# EAGLE design kapcs (EAGLE 7.2.0)
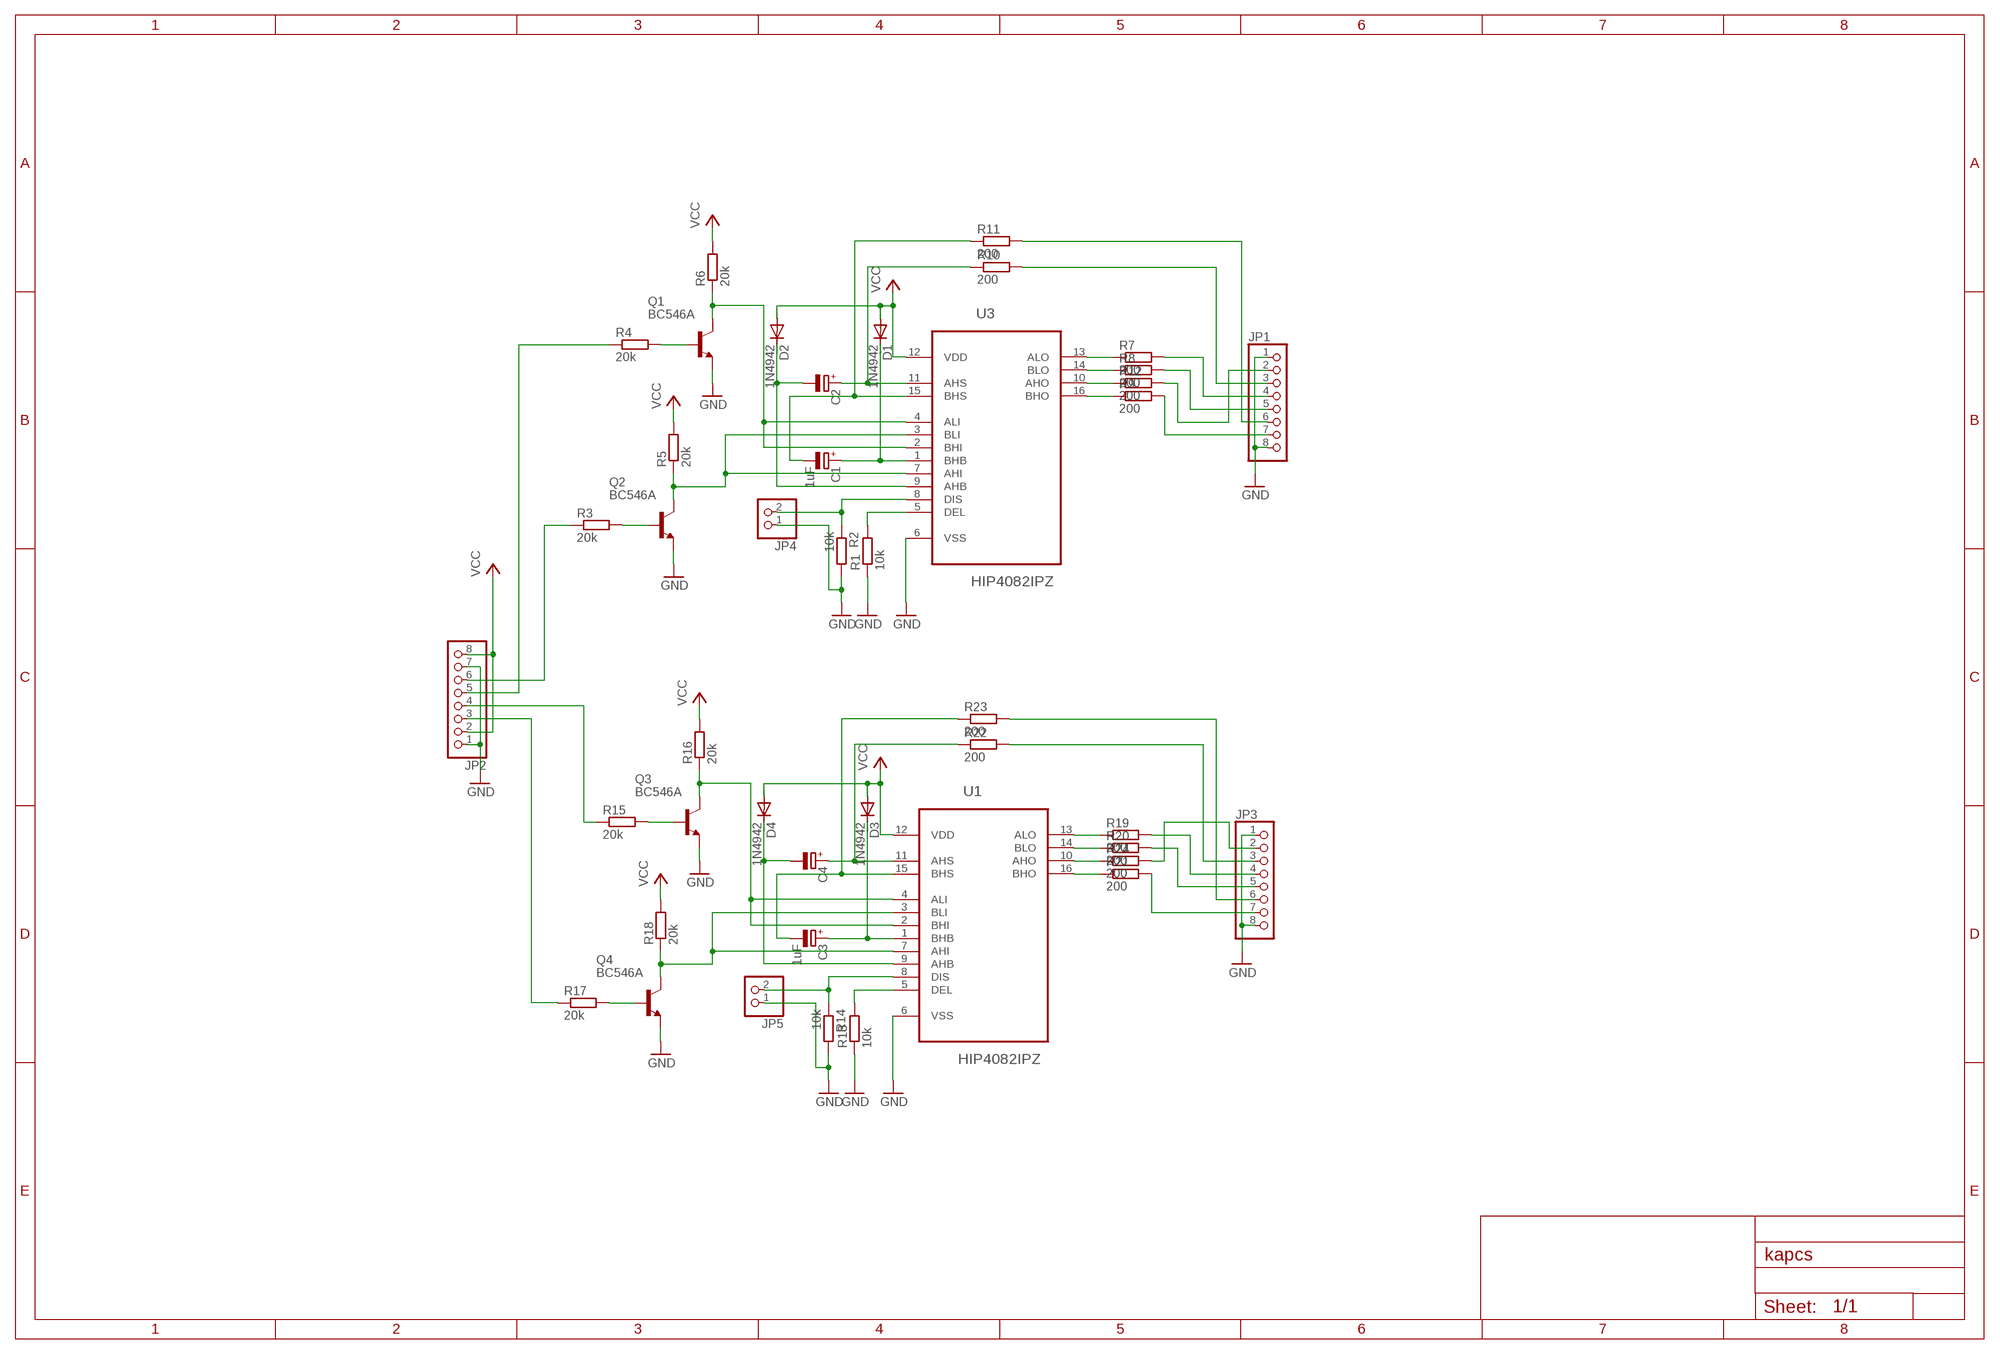
[diagram p0: schematic, sheet 1]

## Parts
C1  1uF  CPOL-EUE2.5-5  [E2,5-5]
C2  CPOL-EUE2.5-5  [E2,5-5]
C3  1uF  CPOL-EUE2.5-5  [E2,5-5]
C4  CPOL-EUE2.5-5  [E2,5-5]
D1  1N4942  [DO41-10]
D2  1N4942  [DO41-10]
D3  1N4942  [DO41-10]
D4  1N4942  [DO41-10]
JP1  PINHD-1X8  [1X08]
JP2  PINHD-1X8  [1X08]
JP3  PINHD-1X8  [1X08]
JP4  PINHD-1X2  [1X02]
JP5  PINHD-1X2  [1X02]
Q1  BC546A  [TO92-EBC]
Q2  BC546A  [TO92-EBC]
Q3  BC546A  [TO92-EBC]
Q4  BC546A  [TO92-EBC]
R1  10k  R-EU_0207/7  [0207/7]
R2  10k  R-EU_0207/7  [0207/7]
R3  20k  R-EU_0207/7  [0207/7]
R4  20k  R-EU_0207/7  [0207/7]
R5  20k  R-EU_0207/7  [0207/7]
R6  20k  R-EU_0207/7  [0207/7]
R7  200  R-EU_0207/7  [0207/7]
R8  200  R-EU_0207/7  [0207/7]
R9  200  R-EU_0207/7  [0207/7]
R10  200  R-EU_0207/7  [0207/7]
R11  200  R-EU_0207/7  [0207/7]
R12  200  R-EU_0207/7  [0207/7]
R13  10k  R-EU_0207/7  [0207/7]
R14  10k  R-EU_0207/7  [0207/7]
R15  20k  R-EU_0207/7  [0207/7]
R16  20k  R-EU_0207/7  [0207/7]
R17  20k  R-EU_0207/7  [0207/7]
R18  20k  R-EU_0207/7  [0207/7]
R19  200  R-EU_0207/7  [0207/7]
R20  200  R-EU_0207/7  [0207/7]
R21  200  R-EU_0207/7  [0207/7]
R22  200  R-EU_0207/7  [0207/7]
R23  200  R-EU_0207/7  [0207/7]
R24  200  R-EU_0207/7  [0207/7]
U1  HIP4082IPZ  [DIP254P762X533-16]
U3  HIP4082IPZ  [DIP254P762X533-16]

## Nets
GND: JP1.1 JP1.8 JP2.1 JP2.7 JP3.1 JP3.8 JP4.1 JP5.1 Q1.E Q2.E Q3.E Q4.E R1.1 R2.2 R13.1 R14.2 U1.6(VSS) U3.6(VSS)
N$1: C1.+ D1.C U3.1(BHB)
N$2: R1.2 U3.5(DEL)
N$3: C2.+ R10.1 U3.11(AHS)
N$4: C2.- D2.C U3.9(AHB)
N$5: C1.- R11.1 U3.15(BHS)
N$6: JP4.2 R2.1 U3.8(DIS)
N$7: Q1.B R4.2
N$8: R9.1 U3.16(BHO)
N$9: Q2.C R5.1 U3.3(BLI) U3.7(AHI)
N$10: Q2.B R3.2
N$11: Q1.C R6.1 U3.2(BHI) U3.4(ALI)
N$12: R12.1 U3.10(AHO)
N$13: R8.1 U3.14(BLO)
N$14: R7.1 U3.13(ALO)
N$16: JP1.3 R10.2
N$17: JP1.4 R7.2
N$18: JP1.5 R8.2
N$19: JP1.2 R12.2
N$20: JP1.7 R9.2
N$21: Q3.B R15.2
N$22: Q4.C R18.1 U1.3(BLI) U1.7(AHI)
N$23: Q4.B R17.2
N$24: Q3.C R16.1 U1.2(BHI) U1.4(ALI)
N$25: JP2.4 R15.1
N$26: C3.+ D3.C U1.1(BHB)
N$27: C3.- R23.1 U1.15(BHS)
N$28: C4.+ R22.1 U1.11(AHS)
N$29: C4.- D4.C U1.9(AHB)
N$30: R13.2 U1.5(DEL)
N$31: JP5.2 R14.1 U1.8(DIS)
N$32: R21.1 U1.16(BHO)
N$33: R24.1 U1.10(AHO)
N$34: R20.1 U1.14(BLO)
N$35: R19.1 U1.13(ALO)
N$36: JP3.6 R23.2
N$37: JP3.3 R22.2
N$38: JP3.4 R19.2
N$39: JP3.5 R20.2
N$40: JP3.2 R24.2
N$41: JP2.5 R4.1
N$42: JP2.6 R3.1
N$43: JP3.7 R21.2
N$44: JP2.3 R17.1
N$45: JP1.6 R11.2
VCC: D1.A D2.A D3.A D4.A JP2.2 JP2.8 R5.2 R6.2 R16.2 R18.2 U1.12(VDD) U3.12(VDD)

## Library data of the parts
C1-C4 = rcl:CPOL-EU: POLARIZED CAPACITOR, European symbol
D1-D4 = diode:1N4942: DIODE 1.0 A, 200 V, 150 ns
JP1-JP3 = pinhead:PINHD-1X8: PIN HEADER
JP4 JP5 = pinhead:PINHD-1X2: PIN HEADER
Q1-Q4 = transistor-npn:BC546*: NPN Transistor
R1-R24 = rcl:R-EU_: RESISTOR, European symbol
U1 U3 = hip4082dip:HIP4082IPZ: 80V, 1.25A Peak Current H-Bridge; MPN: HIP4082IPZ; OC_FARNELL: 9664149; OC_NEWARK: 61J5962; PACKAGE: PDIP-16; SUPPLIER: INTERSIL

## Board
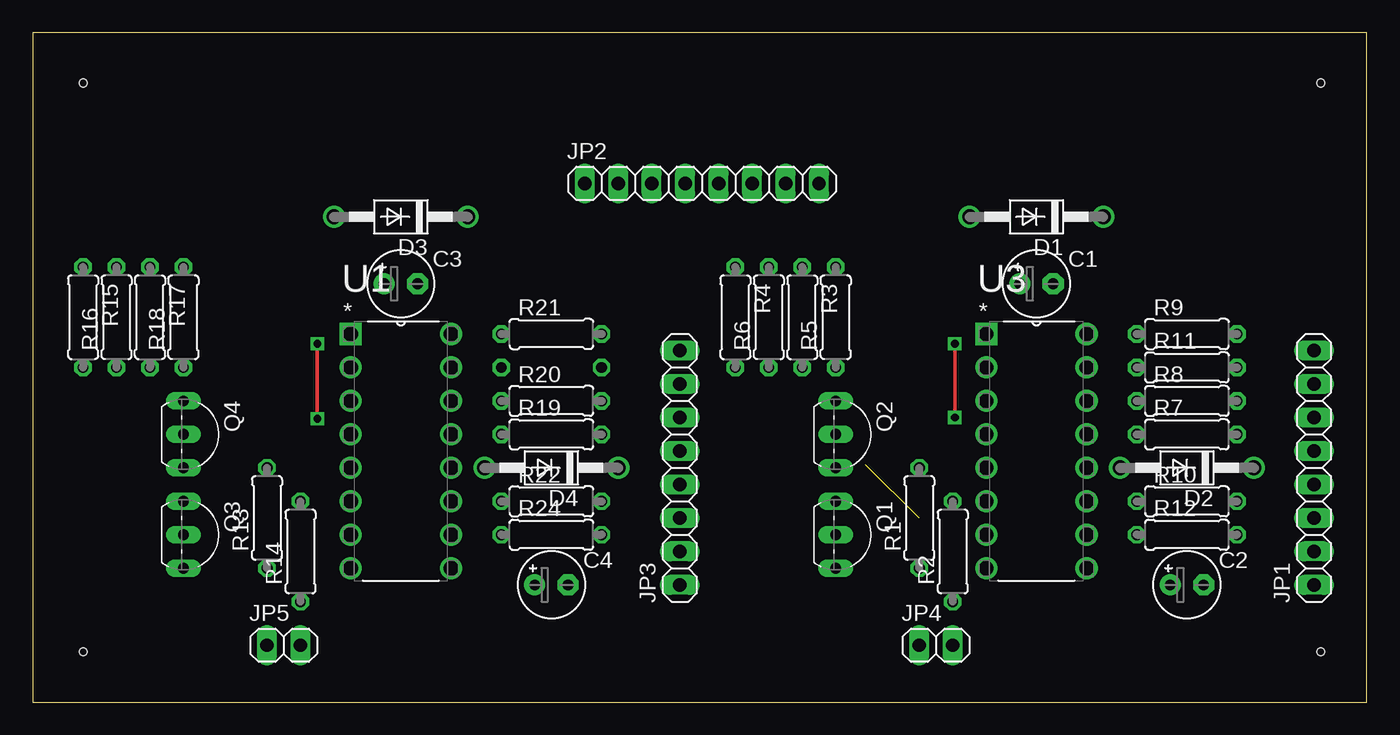
[diagram p1: board, top side]
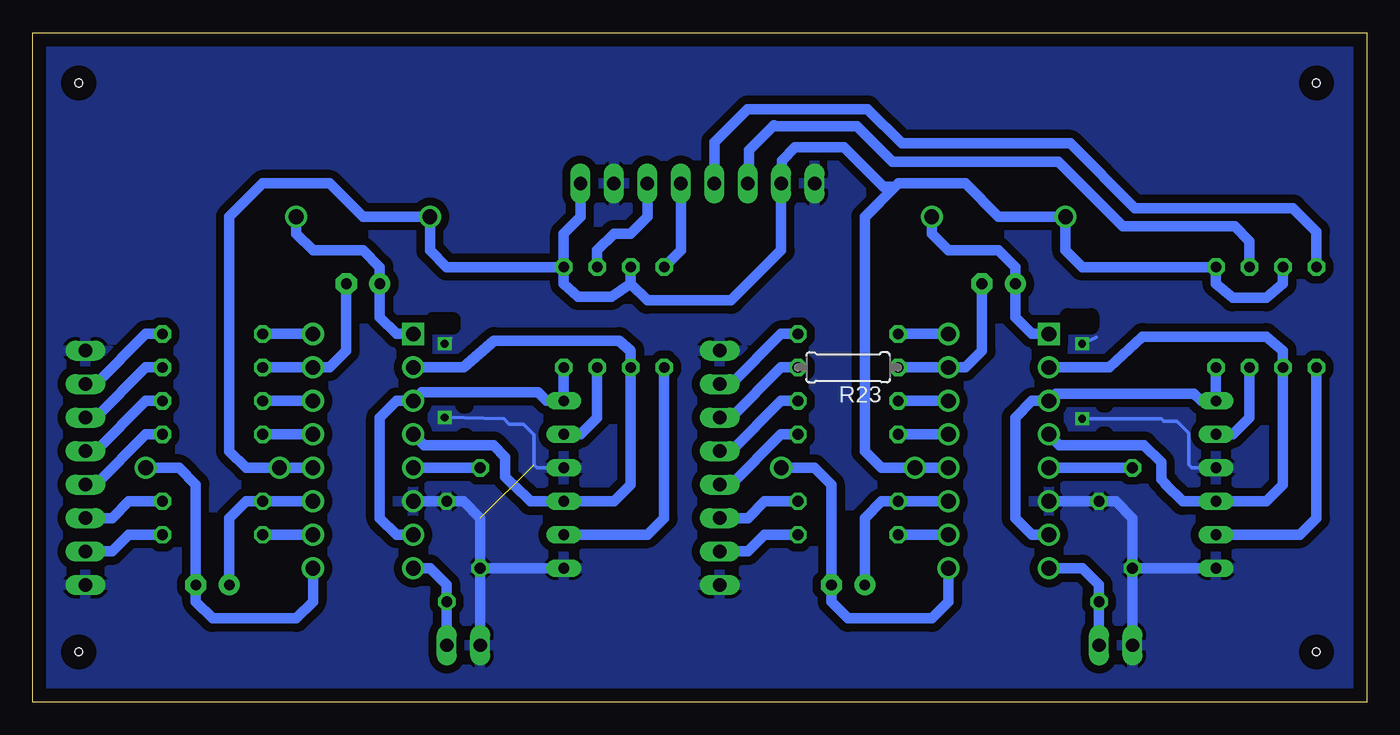
[diagram p2: board, bottom side, seen from below]

Size 101.27 x 50.79 mm. Coordinates in mm from the lower left corner, seen from the top.
Outline: 0,0 101.27,0 101.27,50.79 0,50.79 0,0
Copper layers (1*16): Top 0.035mm / dielectric 1.5mm / Bottom 0.035mm
Design rules "default": minimum track width 10mil, minimum drill 24mil, track to track 8mil, track to pad 8mil, pad to pad 8mil, via to via 8mil, smd to smd 8mil, copper to edge 40mil, drill to drill 8mil, minimum pad ring 10mil, minimum via ring 8mil, stop-mask expansion 4mil, vias tented up to drill 0mil, thermal gap 10mil
Holes 0.6 mm at 3.81,3.81 3.81,46.99 97.79,46.99 97.79,3.81
bRestrict: area 68.4,22.5 to 68.6,22.7; area 68.4,20 to 68.6,20.2; area 69.4,28.5 to 70.9,29; area 19.8,22.6 to 20,22.8; area 19.8,20.1 to 20,20.3; area 20.9,28.5 to 22.7,29.3

### Footprints (pad centres in the part's own frame; a part is rotated, then mirrored left to right if it is on the bottom)
E2,5-5 = drill 0.813 pad 1.6: + -1.27,0 | drill 0.813 pad 1.6 octagon: - 1.27,0
DO41-10 = drill 1.118: A 5.08,0; C -5.08,0
1X08 = drill 1.016 long: 1 -8.89,0; 2 -6.35,0; 3 -3.81,0; 4 -1.27,0; 5 1.27,0; 6 3.81,0; 7 6.35,0; 8 8.89,0
1X02 = drill 1.016 long: 1 -1.27,0; 2 1.27,0
TO92-EBC = drill 0.813 long: B 0,-1.27; C -2.54,-1.27; E 2.54,-1.27
0207/7 = drill 0.813 octagon: 1 -3.81,0; 2 3.81,0
DIP254P762X533-16 = drill 1.118 square: 1 -7.62,17.78 | drill 1.118: 2 -7.62,15.24; 3 -7.62,12.7; 4 -7.62,10.16; 5 -7.62,7.62; 6 -7.62,5.08; 7 -7.62,2.54; 8 -7.62,0; 9 0,0; 10 0,2.54; 11 0,5.08; 12 0,7.62; 13 0,10.16; 14 0,12.7; 15 0,15.24; 16 0,17.78

### Placement (x,y rotation side)
C1  76.2,31.75 0 top
C2  87.63,8.89 0 top
C3  27.94,31.75 0 top
C4  39.37,8.89 0 top
D1  76.2,36.83 180 top
D2  87.63,17.78 180 top
D3  27.94,36.83 180 top
D4  39.37,17.78 180 top
JP1  97.29,17.78 90 top
JP2  50.8,39.37 0 top
JP3  49.13,17.78 90 top
JP4  68.58,4.31 0 top
JP5  19.05,4.31 0 top
Q1  62.23,12.7 270 top
Q2  62.23,20.32 270 top
Q3  12.7,12.7 270 top
Q4  12.7,20.32 270 top
R1  67.31,13.97 90 top
R2  69.85,11.43 90 top
R3  58.42,29.21 270 top
R4  53.34,29.21 270 top
R5  60.96,29.21 90 top
R6  55.88,29.21 90 top
R7  87.63,20.32 0 top
R8  87.63,22.86 0 top
R9  87.63,27.94 0 top
R10  87.63,15.24 0 top
R11  87.63,25.4 0 top
R12  87.63,12.7 0 top
R13  17.78,13.97 90 top
R14  20.32,11.43 90 top
R15  3.81,29.21 270 top
R16  6.35,29.21 90 top
R17  8.89,29.21 270 top
R18  11.43,29.21 90 top
R19  39.37,20.32 0 top
R20  39.37,22.86 0 top
R21  39.37,27.94 0 top
R22  39.37,15.24 0 top
R23  39.37,25.4 180 bottom
R24  39.37,12.7 0 top
U1  31.75,10.16 0 top
U3  80.01,10.16 0 top

### Tracks (layer width: path | path; a pad name or v marks a point on that pad's centre or on a via)
GND  (via drill 0.6)  (1 unrouted)
  Top 0.254: v70,21.6 v70,27.2 | v21.6,21.5 v21.6,27.2
  Bottom 0.254: Q2.E 62.98,17.78 63.2,18 63.2,20.3 64,21.1 65.1,21.1 65.5,21.5 v70,21.6 | v70,27.2 69.5,27.6 | Q4.E 13.28,17.78 13.5,18 13.5,20.4 14.4,21.3 15.4,21.3 15.6,21.5 v21.6,21.5 | v21.6,27.2 20.5,27.7
  Bottom 0.813: JP5.1 R13.1 | R13.1 Q3.E | R13.1 17.78,13.97 19.05,15.24 R14.2 U1.6 | JP4.1 R1.1 | R1.1 Q1.E | R1.1 67.31,13.97 68.58,15.24 R2.2 U3.6
  pour Bottom (isolate 0.61): 0,50.8 101.6,50.8 101.6,0 0,0
N$1
  Bottom 0.813: D1.C 81.28,35.56 80.01,34.29 76.2,34.29 74.93,33.02 C1.+ 74.93,29.21 73.66,27.94 U3.1
N$2
  Bottom 0.813: R1.2 U3.5
N$3
  Bottom 0.813: U3.11 R10.1 85.09,15.24 86.36,13.97 C2.+
N$4
  Bottom 0.813: U3.9 80.01,7.62 81.28,6.35 87.63,6.35 88.9,7.62 C2.- 88.9,16.51 90.17,17.78 D2.C
N$5
  Bottom 0.813: R11.1 U3.15 78.74,25.4 77.47,26.67 C1.-
N$6
  Bottom 0.813: JP4.2 R2.1 69.85,8.89 71.12,10.16 U3.8
N$7
  Bottom 0.813: Q1.B 54.61,12.7 53.34,13.97 R4.2
N$8
  Bottom 0.813: U3.16 R9.1
N$9
  Bottom 0.813: U3.7 73.66,12.7 74.93,13.97 74.93,21.59 73.66,22.86 U3.3 71.75,23.5 62.9,23.5 62.26,22.86 Q2.C R5.1
N$10
  Bottom 0.813: Q2.B 59.69,20.32 58.42,21.59 R3.2
N$11
  Bottom 0.813: U3.2 68.58,25.4 66.24,27.44 56.75,27.44 55.88,26.67 R6.1 55.88,16.51 57.15,15.24 Q1.C 63.5,15.24 64.77,16.51 64.81,16.51 65.4,17.1 65.4,18.6 66.3,19.5 71.57,19.5 U3.4
N$12
  Bottom 0.813: U3.10 R12.1
N$13
  Bottom 0.813: U3.14 R8.1
N$14
  Bottom 0.813: U3.13 R7.1
N$16
  Bottom 0.813: R10.2 93.98,15.24 95.25,13.97 JP1.3
N$17
  Bottom 0.813: R7.2 92.71,20.32 96.52,16.51 JP1.4
N$18
  Bottom 0.813: R8.2 92.71,22.86 96.52,19.05 JP1.5
N$19
  Bottom 0.813: R12.2 93.98,12.7 95.25,11.43 JP1.2
N$20
  Bottom 0.813: R9.2 92.71,27.94 96.52,24.13 JP1.7
N$21
  Bottom 0.813: Q3.B 5.08,12.7 3.81,13.97 R15.2
N$22
  Bottom 0.813: R18.1 Q4.C 12.56,22.86 13.1,23.4 23.59,23.4 U1.3 25.4,22.86 26.67,21.59 26.67,13.97 25.4,12.7 U1.7
N$23
  Bottom 0.813: Q4.B 10.16,20.32 8.89,21.59 R17.2
N$24
  Bottom 0.813: U1.2 19.55,25.4 17.01,27.74 7.62,27.74 6.35,26.67 R16.1 6.35,16.51 7.62,15.24 Q3.C 13.97,15.24 15.24,16.51 15.24,16.54 15.6,16.9 15.6,18.2 16.9,19.5 23.31,19.5 U1.4
N$25
  Bottom 0.813: JP2.4 49.5,39.4 49.5,42.5 47,45 37.9,45 35.3,42.4 22.5,42.4 17.6,37.5 5.6,37.5 3.81,35.71 R15.1
N$26
  Bottom 0.813: U1.1 25.4,27.94 26.67,29.21 C3.+ 26.67,33.02 27.94,34.29 31.75,34.29 33.02,35.56 D3.C
N$27
  Bottom 0.813: R23.1 U1.15 30.48,25.4 29.21,26.67 C3.-
N$28
  Bottom 0.813: U1.11 R22.1 36.83,15.24 38.1,13.97 C4.+
N$29
  Bottom 0.813: D4.C 41.91,17.78 40.64,16.51 C4.- 40.64,7.62 39.37,6.35 33.02,6.35 31.75,7.62 U1.9
N$30
  Bottom 0.813: R13.2 U1.5
N$31
  Bottom 0.813: U1.8 21.59,10.16 20.32,8.89 R14.1 JP5.2
N$32
  Bottom 0.813: U1.16 R21.1
N$33
  Bottom 0.813: U1.10 R24.1
N$34
  Bottom 0.813: U1.14 R20.1
N$35
  Bottom 0.813: U1.13 R19.1
N$36
  Bottom 0.813: R23.2 44.45,25.4 48.26,21.59 JP3.6
N$37
  Bottom 0.813: R22.2 45.72,15.24 46.99,13.97 JP3.3
N$38
  Bottom 0.813: R19.2 44.45,20.32 48.26,16.51 JP3.4
N$39
  Bottom 0.813: R20.2 44.45,22.86 48.26,19.05 JP3.5
N$40
  Bottom 0.813: R24.2 45.72,12.7 46.99,11.43 JP3.2
N$41
  Bottom 0.813: JP2.5 52.07,34.29 R4.1
N$42
  Bottom 0.813: JP2.6 54.61,36.83 55.88,35.56 57.15,35.56 58.42,34.29 R3.1
N$43
  Bottom 0.813: R21.2 44.45,27.94 48.26,24.13 JP3.7
N$44
  Bottom 0.813: 46.99,40.64 JP2.3 46.9,39.46 46.9,41.9 45,43.8 44.9,43.7 38.7,43.7 36,41 23.4,41 18.5,36.1 10,36.1 8.89,34.99 R17.1
N$45
  Bottom 0.813: R11.2 92.71,25.4 96.52,21.59 JP1.6
VCC
  Bottom 0.813: U1.12 D4.A 36.83,17.78 38.1,19.05 38.1,36.83 | 38.1,36.83 35.56,39.37 30.48,39.37 27.94,36.83 D3.A 22.86,34.29 21.59,33.02 R18.2 11.43,31.75 10.16,30.68 7.62,30.68 6.35,31.75 R16.2 | U3.12 D2.A 85.09,17.78 86.36,19.05 86.36,36.83 83.82,39.37 78.74,39.37 76.2,36.83 D1.A 71.12,34.29 69.85,33.02 R5.2 | R6.2 55.88,31.75 | 55.88,31.75 57.35,30.78 59.89,30.78 60.96,31.75 R5.2 | R5.2 60.96,35.56 59.69,36.83 JP2.8 | 55.88,31.75 54.61,30.48 48.26,30.48 44.45,34.29 JP2.2 44.4,39.42 44.4,41.1 43.4,42.1 39.7,42.1 36.7,39.1 35.8,39.1 38.07,36.83 38.1,36.83